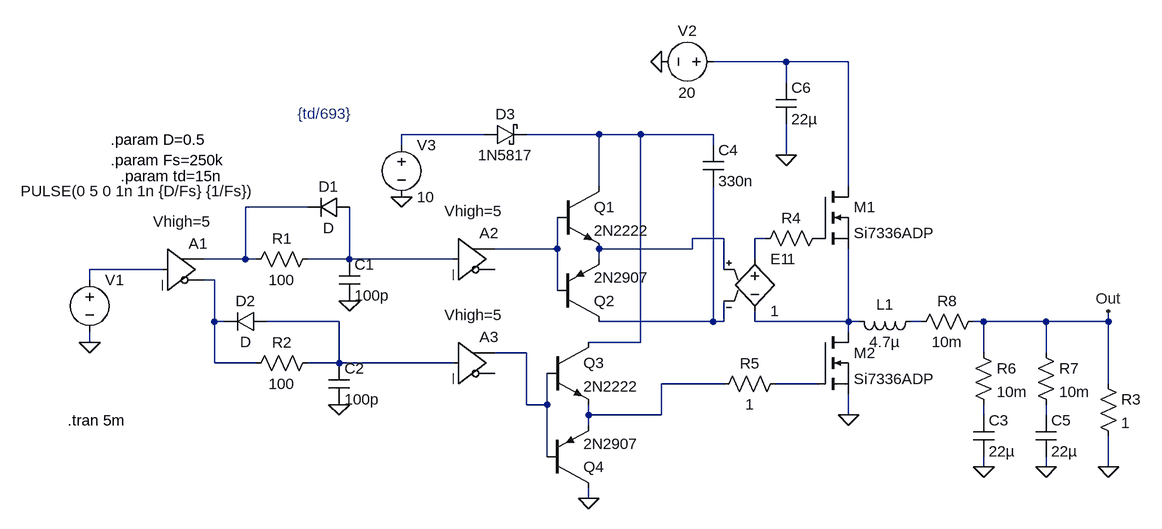
[diagram p0: schematic DeadTime RC SynchBuck.asc]
DeadTime RC SynchBuck.asc, the LTspice schematic file:
Version 4
SHEET 1 1432 680
WIRE 880 -160 768 -160
WIRE 976 -160 880 -160
WIRE 880 -128 880 -160
WIRE 416 -48 288 -48
WIRE 592 -48 480 -48
WIRE 656 -48 592 -48
WIRE 768 -48 656 -48
WIRE 288 -32 288 -48
WIRE 768 -32 768 -48
WIRE 880 -16 880 -64
WIRE 592 32 592 -48
WIRE 976 32 976 -160
WIRE 144 64 48 64
WIRE 784 112 736 112
WIRE 848 112 832 112
WIRE 528 128 528 80
WIRE 528 128 432 128
WIRE 736 128 736 112
WIRE 736 128 592 128
WIRE 48 144 48 64
WIRE 48 144 -16 144
WIRE 64 144 48 144
WIRE 208 144 208 64
WIRE 208 144 144 144
WIRE 368 144 208 144
WIRE 592 144 592 128
WIRE 832 144 832 112
WIRE -80 160 -192 160
WIRE 784 160 784 112
WIRE -192 176 -192 160
WIRE 0 176 -16 176
WIRE 528 192 528 128
WIRE 0 240 0 176
WIRE 16 240 0 240
WIRE 192 240 80 240
WIRE 768 240 768 32
WIRE 768 240 592 240
WIRE 784 240 784 208
WIRE 784 240 768 240
WIRE 832 240 832 224
WIRE 976 240 976 128
WIRE 976 240 832 240
WIRE 992 240 976 240
WIRE 1088 240 1072 240
WIRE 1184 240 1168 240
WIRE 1280 240 1184 240
WIRE 1376 240 1376 224
WIRE 1376 240 1280 240
WIRE 976 256 976 240
WIRE -192 272 -192 256
WIRE 656 272 656 -48
WIRE 656 272 576 272
WIRE 480 288 432 288
WIRE 1184 288 1184 240
WIRE 1280 288 1280 240
WIRE 0 304 0 240
WIRE 64 304 0 304
WIRE 192 304 192 240
WIRE 192 304 144 304
WIRE 368 304 192 304
WIRE 784 336 688 336
WIRE 928 336 864 336
WIRE 1376 336 1376 240
WIRE 480 368 480 288
WIRE 512 368 512 320
WIRE 512 368 480 368
WIRE 576 384 576 368
WIRE 688 384 688 336
WIRE 688 384 576 384
WIRE 976 384 976 352
WIRE 1184 384 1184 368
WIRE 1280 384 1280 368
WIRE 576 400 576 384
WIRE 512 448 512 368
WIRE 1184 464 1184 448
WIRE 1280 464 1280 448
WIRE 1376 464 1376 416
WIRE 576 512 576 496
FLAG -192 272 0
FLAG 208 208 0
FLAG 192 368 0
FLAG 688 -160 0
FLAG 976 384 0
FLAG 1184 464 0
FLAG 1376 464 0
FLAG 1376 224 Out
FLAG 288 48 0
FLAG 576 512 0
FLAG 1280 464 0
FLAG 880 -16 0
SYMBOL voltage -192 160 R0
WINDOW 3 -106 -121 Left 2
WINDOW 123 0 0 Left 0
WINDOW 39 0 0 Left 0
SYMATTR InstName V1
SYMATTR Value PULSE(0 5 0 1n 1n {D/Fs} {1/Fs})
SYMBOL Digital\\buf 368 80 R0
WINDOW 3 -14 -10 Left 2
SYMATTR InstName A2
SYMATTR Value Vhigh=5
SYMBOL res 160 128 R90
WINDOW 0 0 56 VBottom 2
WINDOW 3 32 56 VTop 2
SYMATTR InstName R1
SYMATTR Value 100
SYMBOL res 160 288 R90
WINDOW 0 0 56 VBottom 2
WINDOW 3 32 56 VTop 2
SYMATTR InstName R2
SYMATTR Value 100
SYMBOL cap 192 144 R0
SYMATTR InstName C1
SYMATTR Value 100p
SYMBOL cap 176 304 R0
SYMATTR InstName C2
SYMATTR Value 100p
SYMBOL diode 208 48 R90
WINDOW 0 0 32 VBottom 2
WINDOW 3 32 32 VTop 2
SYMATTR InstName D1
SYMBOL diode 80 224 R90
WINDOW 0 0 32 VBottom 2
WINDOW 3 32 32 VTop 2
SYMATTR InstName D2
SYMBOL Digital\\buf 368 240 R0
WINDOW 3 -14 -10 Left 2
SYMATTR InstName A3
SYMATTR Value Vhigh=5
SYMBOL Digital\\buf -80 96 R0
WINDOW 3 -14 -10 Left 2
SYMATTR InstName A1
SYMATTR Value Vhigh=5
SYMBOL voltage 784 -160 R90
WINDOW 0 -32 56 VBottom 2
WINDOW 3 32 56 VTop 2
SYMATTR InstName V2
SYMATTR Value 20
SYMBOL nmos 928 32 R0
SYMATTR InstName M1
SYMATTR Value Si7336ADP
SYMBOL nmos 928 256 R0
SYMATTR InstName M2
SYMATTR Value Si7336ADP
SYMBOL ind 1088 224 R90
WINDOW 0 5 56 VBottom 2
WINDOW 3 32 56 VTop 2
SYMATTR InstName L1
SYMATTR Value 4.7µ
SYMBOL cap 1168 384 R0
SYMATTR InstName C3
SYMATTR Value 22µ
SYMBOL res 1360 320 R0
SYMATTR InstName R3
SYMATTR Value 1
SYMBOL npn 528 32 R0
SYMATTR InstName Q1
SYMATTR Value 2N2222
SYMBOL voltage 288 -48 R0
SYMATTR InstName V3
SYMATTR Value 10
SYMBOL res 944 96 R90
WINDOW 0 0 56 VBottom 2
WINDOW 3 32 56 VTop 2
SYMATTR InstName R4
SYMATTR Value 1
SYMBOL res 880 320 R90
WINDOW 0 0 56 VBottom 2
WINDOW 3 32 56 VTop 2
SYMATTR InstName R5
SYMATTR Value 1
SYMBOL npn 512 272 R0
SYMATTR InstName Q3
SYMATTR Value 2N2222
SYMBOL pnp 512 496 M180
SYMATTR InstName Q4
SYMATTR Value 2N2907
SYMBOL cap 752 -32 R0
SYMATTR InstName C4
SYMATTR Value 330n
SYMBOL schottky 416 -32 R270
WINDOW 0 32 32 VTop 2
WINDOW 3 0 32 VBottom 2
SYMATTR InstName D3
SYMATTR Value 1N5817
SYMATTR Description Diode
SYMATTR Type diode
SYMBOL pnp 528 240 M180
SYMATTR InstName Q2
SYMATTR Value 2N2907
SYMBOL e 832 128 R0
SYMATTR InstName E1
SYMATTR Value 1
SYMBOL res 1168 272 R0
SYMATTR InstName R6
SYMATTR Value 10m
SYMBOL cap 1264 384 R0
SYMATTR InstName C5
SYMATTR Value 22µ
SYMBOL res 1264 272 R0
SYMATTR InstName R7
SYMATTR Value 10m
SYMBOL res 1184 224 R90
WINDOW 0 0 56 VBottom 2
WINDOW 3 32 56 VTop 2
SYMATTR InstName R8
SYMATTR Value 10m
SYMBOL cap 864 -128 R0
SYMATTR InstName C6
SYMATTR Value 22µ
TEXT -160 -40 Left 2 !.param D=0.5\n.param Fs=250k
TEXT -226 392 Left 2 !.tran 5m
TEXT -144 16 Left 2 !.param td=15n
TEXT 128 -80 Left 2 ;{td/693}

The netlist it stands for:
* DeadTime RC SynchBuck.asc
V1 N009 0 PULSE(0 5 0 1n 1n {D/Fs} {1/Fs})
A2 N008 0 0 0 0 0 N007 0 BUF Vhigh=5
R1 N008 N004 100
R2 N011 N010 100
C1 N008 0 100p
C2 N011 0 100p
D1 N008 N004 D
D2 N011 N010 D
A3 N011 0 0 0 0 0 N015 0 BUF Vhigh=5
A1 N009 0 0 0 0 N010 N004 0 BUF Vhigh=5
V2 N001 0 20
M1 N001 P001 N013 N013 Si7336ADP
M2 N013 N017 0 0 Si7336ADP
L1 N014 N013 4.7µ
C3 N018 0 22µ
R3 Out 0 1
Q1 N003 N007 N005 0 2N2222
V3 N002 0 10
R4 P001 N006 1
R5 N017 N016 1
Q3 N003 N015 N016 0 2N2222
Q4 0 N015 N016 0 2N2907
C4 N003 N012 330n
D3 N002 N003 1N5817
Q2 N012 N007 N005 0 2N2907
E1 N006 N013 N005 N012 1
R6 Out N018 10m
C5 N019 0 22µ
R7 Out N019 10m
R8 Out N014 10m
C6 N001 0 22µ
.model D D
.lib standard.dio
.model NPN NPN
.model PNP PNP
.lib standard.bjt
.model NMOS NMOS
.model PMOS PMOS
.lib standard.mos
.param D=0.5
.param Fs=250k
.tran 5m
.param td=15n
* {td/693}
.backanno
.end